# Altium schematic sheet 金彭LED原理图.SchDoc
size A3
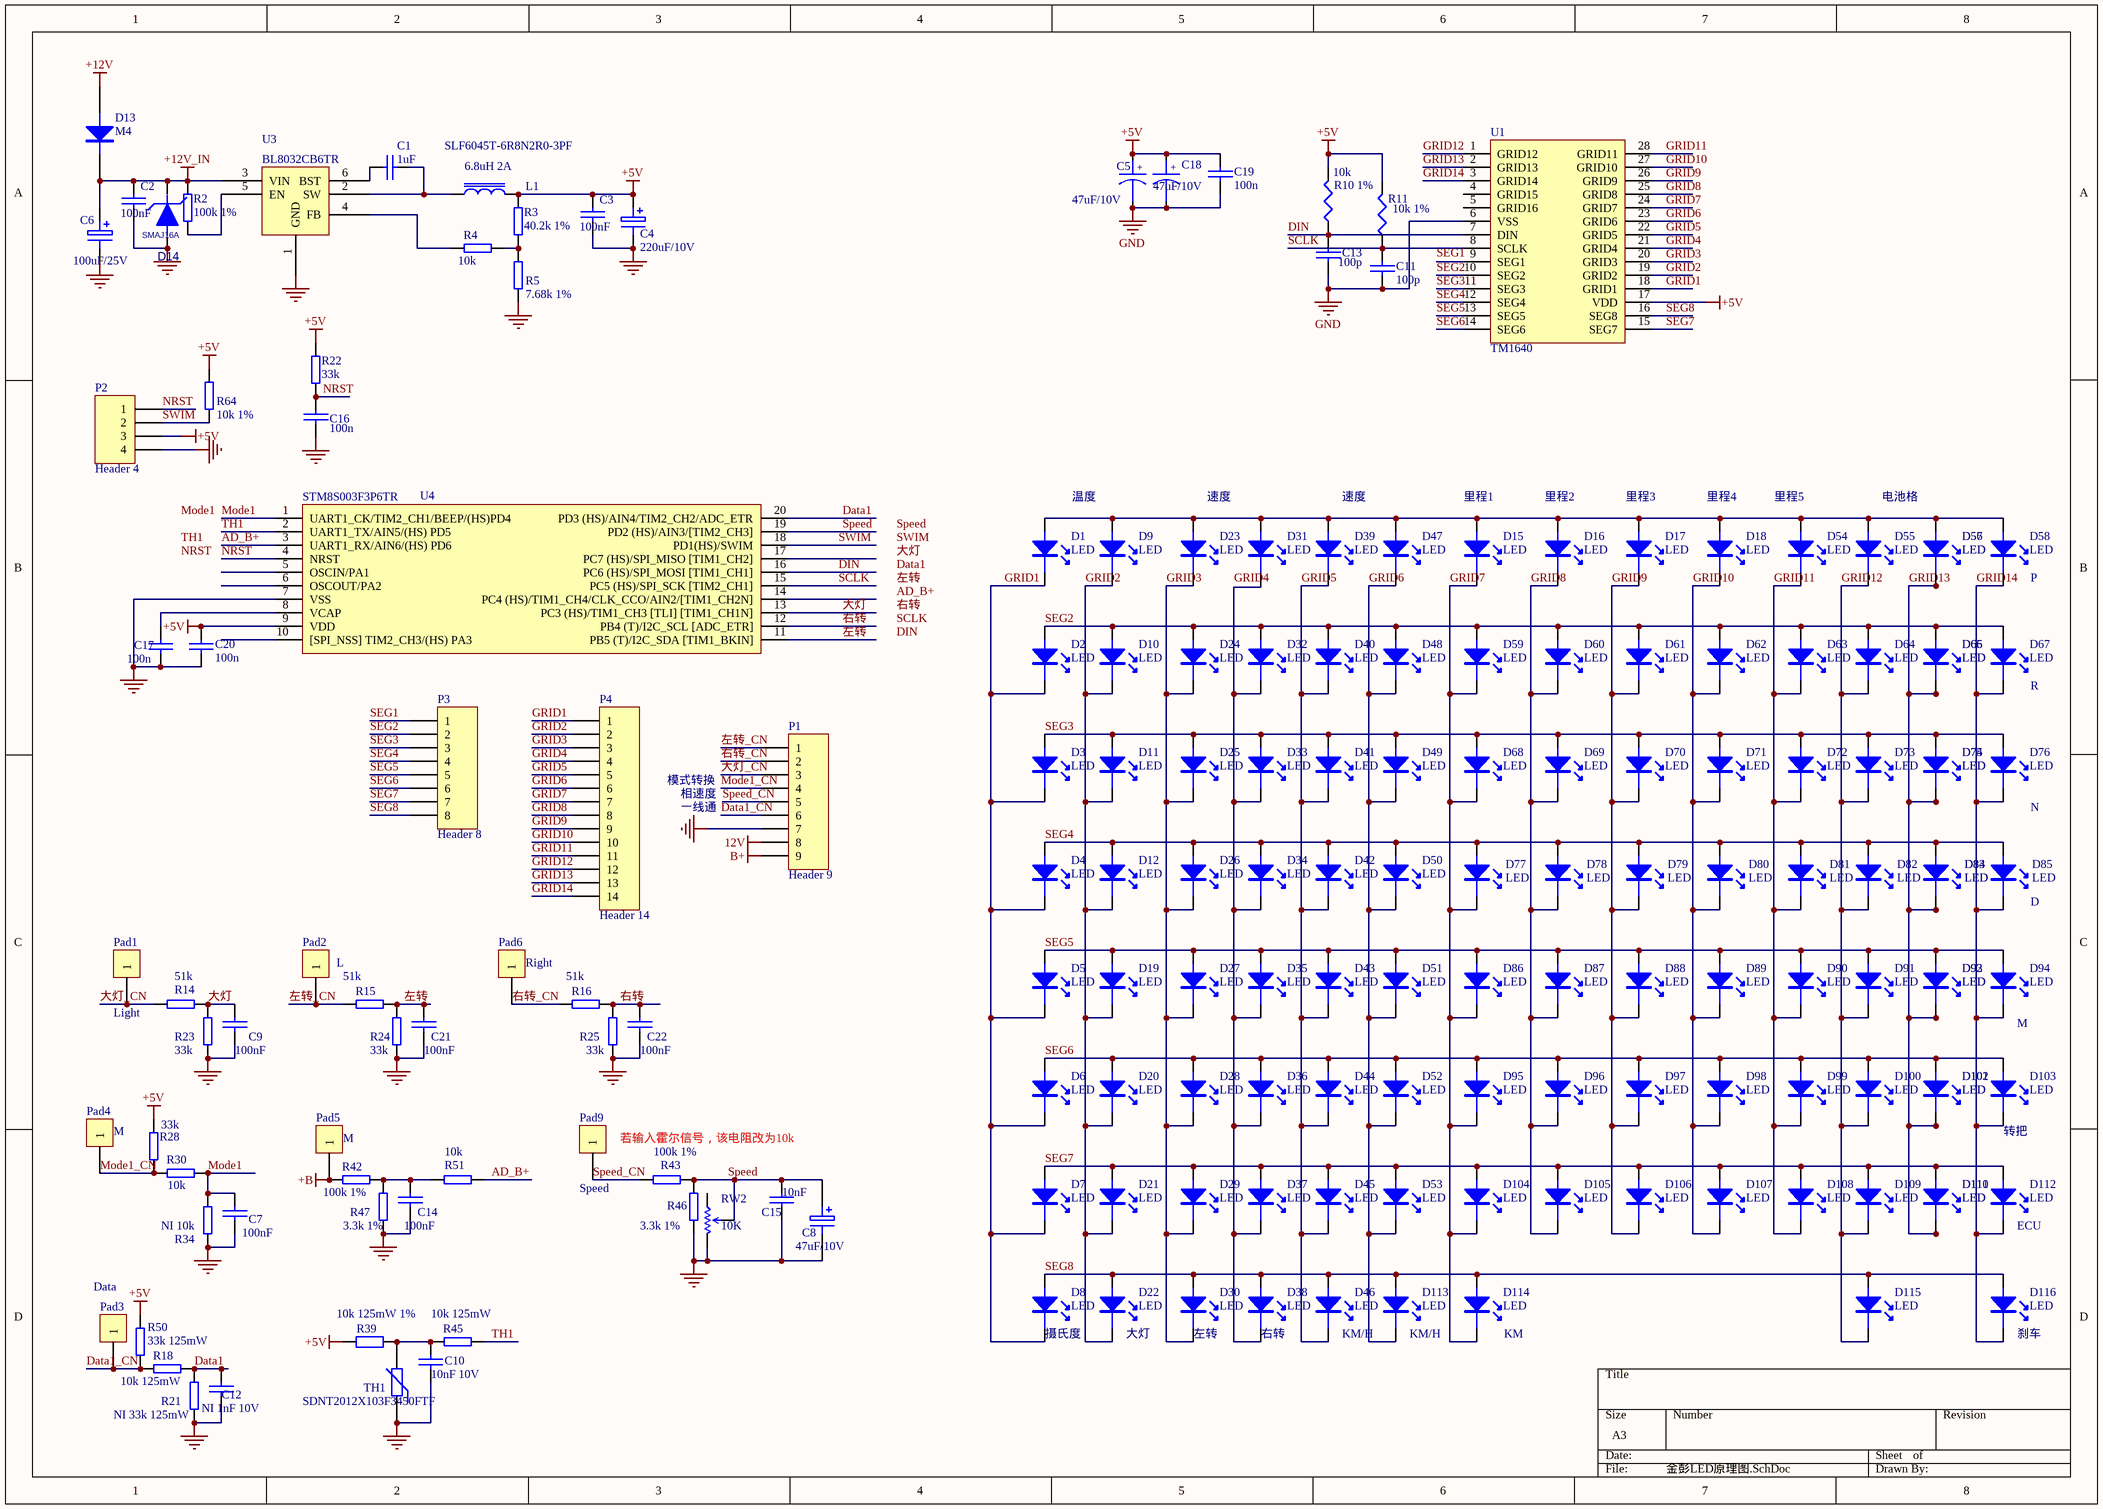
[diagram p0: 金彭LED原理图.SchDoc]

## Parts
C1  1uF  [0805]
C2  100nF  [0805]
C3  100nF  [0805]
C4  220uF/10V  [CE-D6.4]
C5  47uF/10V  [CE-D5.2]
C6  100uF/25V  [RB.2/.4]
C7  100nF  [0805]
C8  47uF/10V  [RB.1/.2]
C9  100nF  [0805]
C10  10nF 10V  [0603]
C11  100p  [0805]
C12  NI 1nF 10V  [0603]
C13  100p  [0805]
C14  100nF  [0805]
C15  10nF  [0603]
C16  100n  [0603]
C17  100n  [0603]
C18  47uF/10V  [CE-D5.2]
C19  100n  [0603]
C20  100n  [0603]
C21  100nF  [0805]
C22  100nF  [0805]
D1  LED  [0603]
D2  LED  [0603]
D3  LED  [0603]
D4  LED  [0603]
D5  LED  [0603]
D6  LED  [0603]
D7  LED  [0603]
D8  LED  [0603]
D9  LED  [0603]
D10  LED  [0603]
D11  LED  [0603]
D12  LED  [0603]
D13  M4  [SMA]
D14  SMAJ16A  [SMA]
D15  LED  [0603]
D16  LED  [0603]
D17  LED  [0603]
D18  LED  [0603]
D19  LED  [0603]
D20  LED  [0603]
D21  LED  [0603]
D22  LED  [0603]
D23  LED  [0603]
D24  LED  [0603]
D25  LED  [0603]
D26  LED  [0603]
D27  LED  [0603]
D28  LED  [0603]
D29  LED  [0603]
D30  LED  [0603]
D31  LED  [0603]
D32  LED  [0603]
D33  LED  [0603]
D34  LED  [0603]
D35  LED  [0603]
D36  LED  [0603]
D37  LED  [0603]
D38  LED  [0603]
D39  LED  [0603]
D40  LED  [0603]
D41  LED  [0603]
D42  LED  [0603]
D43  LED  [0603]
D44  LED  [0603]
D45  LED  [0603]
D46  LED  [0603]
D47  LED  [0603]
D48  LED  [0603]
D49  LED  [0603]
D50  LED  [0603]
D51  LED  [0603]
D52  LED  [0603]
D53  LED  [0603]
D54  LED  [0603]
D55  LED  [0603]
D56  LED  [0603]
D57  LED  [0603]
D58  LED  [0603]
D59  LED  [0603]
D60  LED  [0603]
D61  LED  [0603]
D62  LED  [0603]
D63  LED  [0603]
D64  LED  [0603]
D65  LED  [0603]
D66  LED  [0603]
D67  LED  [0603]
D68  LED  [0603]
D69  LED  [0603]
D70  LED  [0603]
D71  LED  [0603]
D72  LED  [0603]
D73  LED  [0603]
D74  LED  [0603]
D75  LED  [0603]
D76  LED  [0603]
D77  LED  [0603]
D78  LED  [0603]
D79  LED  [0603]
D80  LED  [0603]
D81  LED  [0603]
D82  LED  [0603]
D83  LED  [0603]
D84  LED  [0603]
D85  LED  [0603]
D86  LED  [0603]
D87  LED  [0603]
D88  LED  [0603]
D89  LED  [0603]
D90  LED  [0603]
D91  LED  [0603]
D92  LED  [0603]
D93  LED  [0603]
D94  LED  [0603]
D95  LED  [0603]
D96  LED  [0603]
D97  LED  [0603]
D98  LED  [0603]
D99  LED  [0603]
D100  LED  [0603]
D101  LED  [0603]
D102  LED  [0603]
D103  LED  [0603]
D104  LED  [0603]
D105  LED  [0603]
D106  LED  [0603]
D107  LED  [0603]
D108  LED  [0603]
D109  LED  [0603]
D110  LED  [0603]
D111  LED  [0603]
D112  LED  [0603]
D113  LED  [0603]
D114  LED  [0603]
D115  LED  [0603]
D116  LED  [0603]
L1  SLF6045T-6R8N2R0-3PF  [L6025]
P1  Header 9  [SIP9]
P2  Header 4  [HDR1X4]
P3  Header 8  [HDR1X8]
P4  Header 14  [HDR1X14]
Pad1  Light  [PAD]
Pad2  L  [PAD]
Pad3  Data  [PAD]
Pad4  M  [PAD]
Pad5  M  [PAD]
Pad6  Right  [PAD]
Pad9  Speed  [PAD]
R2  100k 1%  [0805]
R3  40.2k 1%  [0805]
R4  10k  [0603]
R5  7.68k 1%  [0603]
R10_1%  10k  [0805]
R11  10k 1%  [0805]
R14  51k  [0805]
R15  51k  [0805]
R16  51k  [0805]
R18  10k 125mW  [0805]
R21  NI 33k 125mW  [0805]
R22  33k  [0805]
R23  33k  [0805]
R24  33k  [0805]
R25  33k  [0805]
R28  33k  [0805]
R30  10k  [0805]
R34  NI 10k  [0805]
R39  10k 125mW 1%  [0805]
R42  100k 1%  [0805]
R43  100k 1%  [0805]
R45  10k 125mW  [0805]
R46  3.3k 1%  [0805]
R47  3.3k 1%  [0805]
R50  33k 125mW  [0805]
R51  10k  [0805]
R64  10k 1%  [0805]
RW2  10K  [RW-3*3SMD]
TH1  SDNT2012X103F3450FTF  [0805]
U1  TM1640  [SOP28]
U3  BL8032CB6TR  [SOT23-6-BL]
U4  STM8S003F3P6TR  [SSOP20]

## Nets
12V: P1.8
+5V: C3.1 C4.1 C5.1 C18.1 C19.2 C20.2 L1.2 P2.3 R3.1 R10_1%.2 R11.2 R22.2 R28.1 R39.2 R50.1 R64.1 U1.17(VDD) U4.9(VDD)
+12V: D13.1(A)
+12V_IN: C2.1 C6.1 D13.2(K) D14.2 R2.1 U3.3(VIN)
+B: Pad5.1 R42.2
B+: P1.9
GND: C2.2 C3.2 C4.2 C5.2 C6.2 C7.2 C8.2 C9.2 C10.2 C11.1 C12.2 C13.1 C14.2 C15.2 C16.1 C17.2 C18.2 C19.1 C20.1 C21.2 C22.2 D14.1 P1.7 P2.4 R5.1 R21.2 R23.2 R24.2 R25.2 R34.2 R46.2 R47.2 RW2.1 TH1.1 U1.6(VSS) U3.1(GND) U4.7(VSS)
AD_B+: R51.1 U4.3(UART1_RX/AIN6/(HS)_PD6)
Data1: C12.1 R18.1 R21.1 U4.20(PD3_(HS)/AIN4/TIM2_CH2/ADC_ETR)
Data1_CN: P1.6 Pad3.1 R18.2 R50.2
DIN: C13.2 R10_1%.1 U1.7(DIN) U4.16(PC6_(HS)/SPI_MOSI_[TIM1_CH1])
GRID1: D1.2 D2.2 D3.2 D4.2 D5.2 D6.2 D7.2 D8.2 P4.1 U1.18(GRID1)
GRID2: D9.2 D10.2 D11.2 D12.2 D19.2 D20.2 D21.2 D22.2 P4.2 U1.19(GRID2)
GRID3: D23.2 D24.2 D25.2 D26.2 D27.2 D28.2 D29.2 D30.2 P4.3 U1.20(GRID3)
GRID4: P4.4 U1.21(GRID4)
GRID5: D39.2 D40.2 D41.2 D42.2 D43.2 D44.2 D45.2 D46.2 P4.5 U1.22(GRID5)
GRID6: D47.2 D48.2 D49.2 D50.2 D51.2 D52.2 D53.2 D113.2 P4.6 U1.23(GRID6)
GRID7: D15.2 D59.2 D68.2 D77.2 D86.2 D95.2 D104.2 D114.2 P4.7 U1.24(GRID7)
GRID8: D16.2 D60.2 D69.2 D78.2 D87.2 D96.2 D105.2 P4.8 U1.25(GRID8)
GRID9: D17.2 D61.2 D70.2 D79.2 D88.2 D97.2 D106.2 P4.9 U1.26(GRID9)
GRID10: D18.2 D62.2 D71.2 D80.2 D89.2 D98.2 D107.2 P4.10 U1.27(GRID10)
GRID11: D54.2 D63.2 D72.2 D81.2 D90.2 D99.2 D108.2 P4.11 U1.28(GRID11)
GRID12: D55.2 D64.2 D73.2 D82.2 D91.2 D100.2 D109.2 D115.2 P4.12 U1.1(GRID12)
GRID13: D56.2 D57.2 D65.2 D66.2 D74.2 D75.2 D83.2 D84.2 D92.2 D93.2 D101.2 D102.2 D110.2 D111.2 P4.13 U1.2(GRID13)
GRID14: D58.2 D67.2 D76.2 D85.2 D94.2 D103.2 D112.2 D116.2 P4.14 U1.3(GRID14)
Mode1: C7.1 R30.1 R34.1 U4.1(UART1_CK/TIM2_CH1/BEEP/(HS)PD4)
Mode1_CN: P1.4 Pad4.1 R28.2 R30.2
NRST: C16.2 P2.1 R22.1 U4.4(NRST)
SCLK: C11.2 R11.1 U1.8(SCLK) U4.15(PC5_(HS)/SPI_SCK_[TIM2_CH1])
SEG1: P3.1
SEG2: D2.1 D10.1 D24.1 D32.1 D40.1 D48.1 D59.1 D60.1 D61.1 D62.1 D63.1 D64.1 D65.1 D66.1 D67.1 P3.2 U1.10(SEG2)
SEG3: D3.1 D11.1 D25.1 D33.1 D41.1 D49.1 D68.1 D69.1 D70.1 D71.1 D72.1 D73.1 D74.1 D75.1 D76.1 P3.3 U1.11(SEG3)
SEG4: D4.1 D12.1 D26.1 D34.1 D42.1 D50.1 D77.1 D78.1 D79.1 D80.1 D81.1 D82.1 D83.1 D84.1 D85.1 P3.4 U1.12(SEG4)
SEG5: D5.1 D19.1 D27.1 D35.1 D43.1 D51.1 D86.1 D87.1 D88.1 D89.1 D90.1 D91.1 D92.1 D93.1 D94.1 P3.5 U1.13(SEG5)
SEG6: D6.1 D20.1 D28.1 D36.1 D44.1 D52.1 D95.1 D96.1 D97.1 D98.1 D99.1 D100.1 D101.1 D102.1 D103.1 P3.6 U1.14(SEG6)
SEG7: D7.1 D21.1 D29.1 D37.1 D45.1 D53.1 D104.1 D105.1 D106.1 D107.1 D108.1 D109.1 D110.1 D111.1 D112.1 P3.7 U1.15(SEG7)
SEG8: D8.1 D22.1 D30.1 D38.1 D46.1 D113.1 D114.1 D115.1 D116.1 P3.8 U1.16(SEG8)
Speed: C8.1 C15.1 R43.1 R46.1 RW2.3 U4.19(PD2_(HS)/AIN3/[TIM2_CH3])
Speed_CN: P1.5 Pad9.1 R43.2
SWIM: P2.2 R64.2 U4.18(PD1(HS)/SWIM)
TH1: R45.1 U4.2(UART1_TX/AIN5/(HS)_PD5)
右转: C22.1 R16.1 R25.1 U4.12(PB4_(T)/I2C_SCL_[ADC_ETR])
右转_CN: P1.2 Pad6.1 R16.2
大灯: C9.1 R14.1 R23.1 U4.13(PC3_(HS)/TIM1_CH3_[TLI]_[TIM1_CH1N])
大灯_CN: P1.3 Pad1.1 R14.2
左转: C21.1 R15.1 R24.1 U4.11(PB5_(T)/I2C_SDA_[TIM1_BKIN])
左转_CN: P1.1 Pad2.1 R15.2
NetC1_1: C1.1 L1.1 U3.2(SW)
NetC1_2: C1.2 U3.6(BST)
NetC10_1: C10.1 R39.1 R45.2 TH1.2
NetC14_1: C14.1 R42.1 R47.1 R51.2
NetC17_1: C17.1 U4.8(VCAP)
NetD1_1: D1.1 D9.1 D15.1 D16.1 D17.1 D18.1 D23.1 D31.1 D39.1 D47.1 D54.1 D55.1 D56.1 D57.1 D58.1
NetD31_2: D31.2 D32.2 D33.2 D34.2 D35.2 D36.2 D37.2 D38.2
NetR2_2: R2.2 U3.5(EN)
NetR3_2: R3.2 R4.1 R5.2
NetR4_2: R4.2 U3.4(FB)

Not connected (* = marked no-connect by the designer): RW2 2; U1 4(GRID15) 5(GRID16) 9(SEG1); U4 5(OSCIN/PA1) 6(OSCOUT/PA2) 10([SPI_NSS]_TIM2_CH3/(HS)_PA3) 14(PC4_(HS)/TIM1_CH4/CLK_CCO/AIN2/[TIM1_CH2N]) 17(PC7_(HS)/SPI_MISO_[TIM1_CH2])

## Notes on the sheet
- 温度
- (near D23) 速度
- (near D39) 速度
- (near D15) 里程1
- (near D16) 里程2
- (near D17) 里程3
- (near D18) 里程4
- (near D54) 里程5
- 电池格
- (near D58) P
- (near D67) R
- 模式转换
- 一线通
- 相速度
- N
- (near D85) D
- (near D94) M
- 若输入霍尔信号，该电阻改为10k
- (near D103) 转把
- (near D112) ECU
- (near D8) 摄氏度
- (near D22) 大灯
- (near D30) 左转
- (near D38) 右转
- (near D46) KM/H
- (near D113) KM/H
- (near D114) KM
- (near D116) 刹车
- Labels drawn without touching a wire or pin: AD_B+, Data1, DIN, GRID4, Mode1, NRST, SCLK, SEG1, Speed, SWIM, TH1, 右转, 大灯, 左转
- (in symbol Capacitor) +
- (in symbol WHLL) 6.8uH 2A

## Library data of the parts
C1 = WHLCAP
C2 C3 C7 C9 C10 C12 C14 C15 C17 C21 C22 = CAP: Capacitor
C4 C6 = ELECTRO1: Electrolytic Capacitor
C5 C18 = Capacitor
C8 = ELECTRO1: Electrolytic Capacitor; Pressure: 25V
C11 C13 C16 C19 C20 = Cap
D13 = DIODE
D14 = DO-214AC_SMAJ: 5.1V,500mW,323; Manufacture 1: VISHAY; 中文名称: 贴片TVS二极管; 物料描述: SMA-DO-214AC; Geometry.Height: 1.1mm; Value: SMAJ16A; PCB DECAL: DO-214AC_SMAJ
L1 = WHLL
P1 = Header 9: Header, 9-Pin; LatestRevisionDate: 17-Jul-2002; LatestRevisionNote: Re-released for DXP Platform.; Publisher: Altium Limited
P2 = Header 4: Header, 4-Pin; LatestRevisionDate: 17-Jul-2002; LatestRevisionNote: Re-released for DXP Platform.; Publisher: Altium Limited
P3 = Header 8: Header, 8-Pin; LatestRevisionDate: 17-Jul-2002; LatestRevisionNote: Re-released for DXP Platform.; Publisher: Altium Limited
P4 = Header 14: Header, 14-Pin; LatestRevisionDate: 17-Jul-2002; LatestRevisionNote: Re-released for DXP Platform.; Publisher: Altium Limited
Pad1-Pad6 Pad9 = CON1: Connector
R2-R5 R14-R16 R18 R21 R23-R25 R28 R30 R34 R42 R43 R45-R47 R50 R51 R64 = WHLRES
R10_1% R11 = RES1
R22 = WHLRES: Power: 125mW
R39 = Res2: Resistor; Published: 8-Jun-2000; LatestRevisionDate: 17-Jul-2002; LatestRevisionNote: Re-released for DXP Platform.; PackageReference: AXIAL-0.4; Publisher: Altium Limited
RW2 = RW1
TH1 = Res Varistor: Varistor (Voltage-Sensitive Resistor); Published: 24-Mar-1999; LatestRevisionDate: 04-Mar-2005; LatestRevisionNote: PCB Footprint replaced.; PackageReference: 6-0805; Publisher: Altium Limited
U3 = BL8032
U4 = STM8S003F3P6